# EAGLE design mini system- 5 components vertical moved nano (EAGLE 9.2.2)
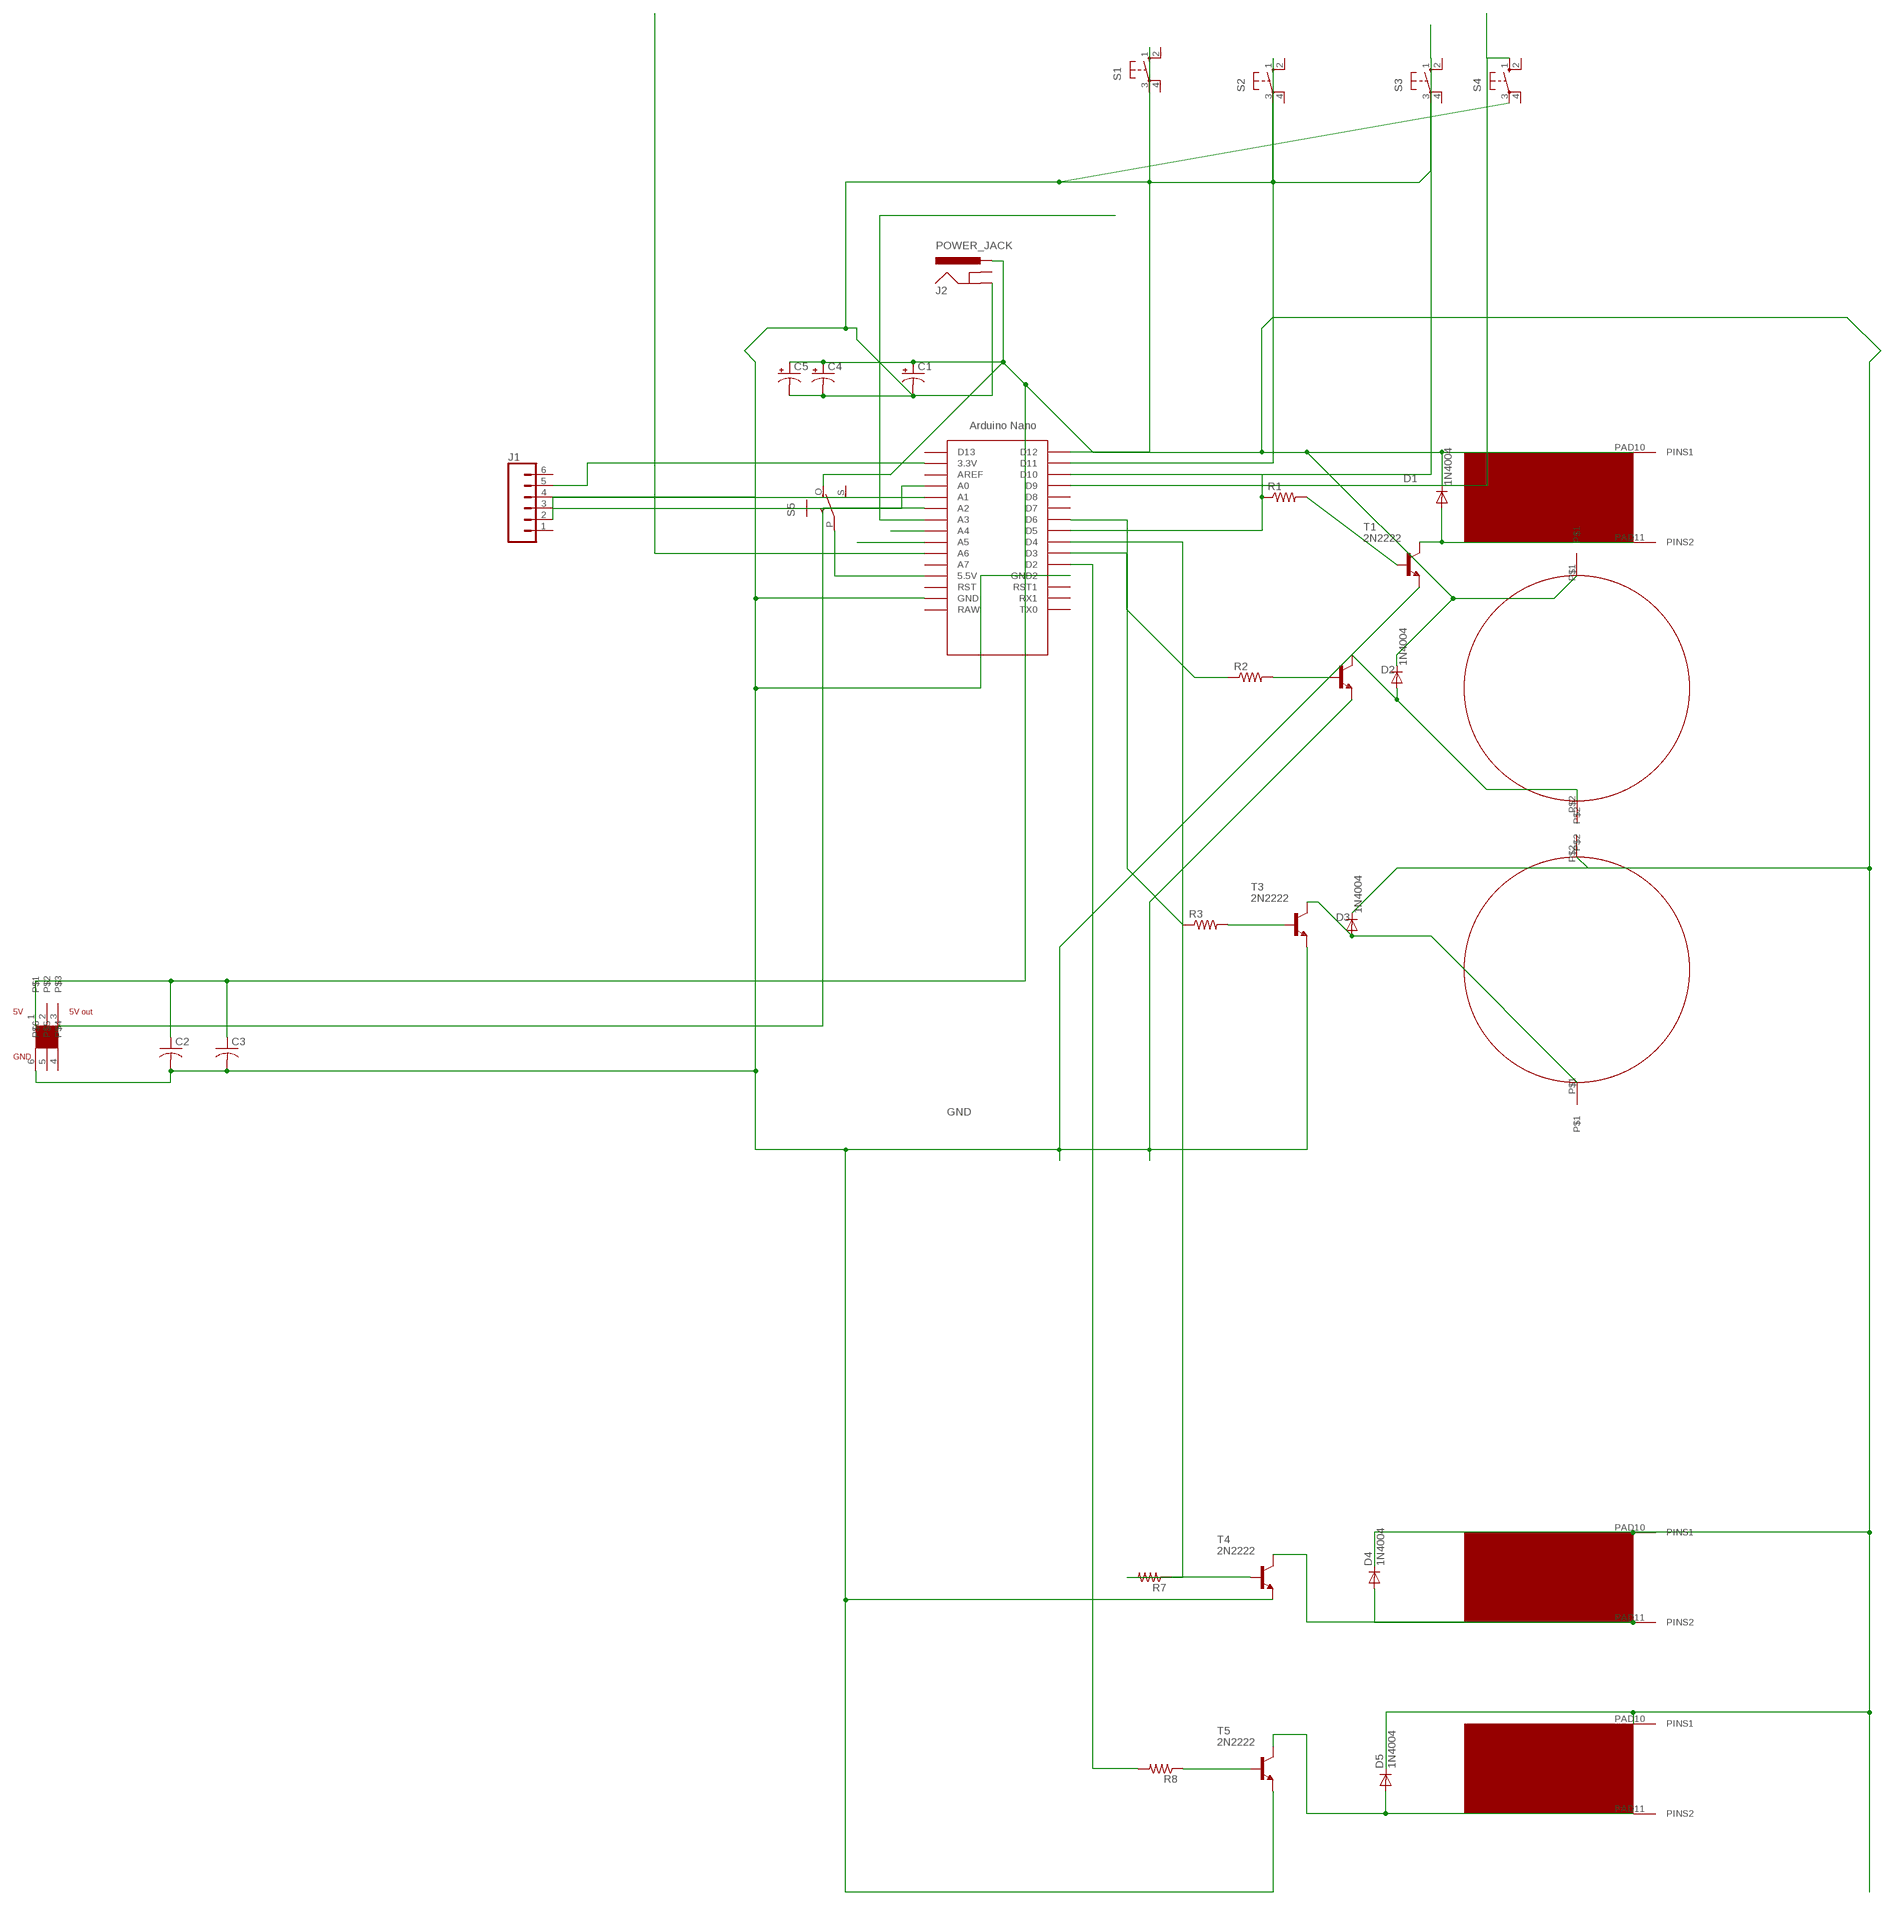
[diagram p0: schematic, sheet 1]

## Parts
C1  CPOL-USE2.5-5  [E2,5-5]
C2  C-US025-024X044  [C025-024X044]
C3  C-US025-024X044  [C025-024X044]
C4  CPOL-USE2.5-5  [E2,5-5]
C5  CPOL-USE2.5-7  [E2,5-7]
D1  1N4004  [DO41-10]
D2  1N4004  [DO41-10]
D3  1N4004  [DO41-10]
D4  1N4004  [DO41-10]
D5  1N4004  [DO41-10]
J1  CONN_06SILK_FEMALE_PTH  [1X06]
J2  POWER_JACK  [POWER_JACK_PTH]
PUMP1  DCPUMP  [PUMP]
R1  R-US_0207/10  [0207/10]
R2  R-US_0207/10  [0207/10]
R3  R-US_0207/10  [0207/10]
R7  R-US_0207/10  [0207/10]
R8  R-US_0207/10  [0207/10]
S1  10-XX  [B3F-10XX]
S2  10-XX  [B3F-10XX]
S3  10-XX  [B3F-10XX]
S4  10-XX  [B3F-10XX]
S5  EG1218S  [EG1218]
T1  2N2222  [TO92-EBC-OVAL]
T2  2N2222  [TO92-EBC-OVAL]
T3  2N2222  [TO92-EBC-OVAL]
T4  2N2222  [TO92-EBC-OVAL]
T5  2N2222  [TO92-EBC-OVAL]
U$1  NANO  [NANO]
U$2  VALVE  [VALVTEST2]
U$3  VALVE  [VALVTEST2]
U$4  DCPUMP  [PUMP]
U$6  VALVE  [VALVTEST2]
U$7  ADP5101  [DIP750W53P254L720H850Q6B]

## Nets
5V: C1.+ C2.1 C3.1 C4.+ C5.+ D1.C D2.C D3.C D4.C D5.C J2.PWR PUMP1.P$1 S5.O U$2.PAD10(PINS1) U$3.PAD10(PINS1) U$4.P$2 U$6.PAD10(PINS1) U$7.1
GND: C1.- C2.2 C3.2 C4.- C5.- J1.4 J2.GND S1.3(P) S2.3(P) S3.3(P) S4.3(P) T1.E T2.E T3.E T4.E T5.E U$1.GND U$1.GND1(GND2) U$7.6
N$1: R1.2 T1.B
N$2: R2.2 T2.B
N$3: R3.2 T3.B
N$4: R1.1 U$1.D5
N$5: D2.A PUMP1.P$2 T2.C
N$6: R3.1 U$1.D6
N$7: R2.1 U$1.D3
N$8: D1.A T1.C U$2.PAD11(PINS2)
N$9: D3.A T3.C U$4.P$1
N$10: R8.2 U$1.D2
N$11: U$1.A3
N$12: J1.5 U$1.3.3V
N$13: J1.3 U$1.A0
N$14: S5.P U$1.5V(5.5V)
N$15: J1.2 U$1.A1
N$16: D4.A T4.C U$3.PAD11(PINS2)
N$17: R7.1 T4.B
N$18: R7.2 U$1.D4
N$19: U$1.A5
N$20: R8.1 T5.B
N$21: D5.A T5.C U$6.PAD11(PINS2)
N$22: U$1.A2 U$7.3
N$23: U$1.A4
N$24: U$1.A6
N$25: S3.1(S) U$1.D10
N$27: S4.1(S) U$1.D9
N$28: S2.1(S) U$1.D11
N$29: S1.1(S) U$1.D12
Unconnected: J1.1 J1.6 J2.GNDBREAK S1.2(S1) S1.4(P1) S2.2(S1) S2.4(P1) S3.2(S1) S3.4(P1) S4.2(S1) S4.4(P1) S5.S U$1.A7 U$1.AREF U$1.D7 U$1.D8 U$1.D13 U$1.RAW U$1.RST U$1.RST1 U$1.RX1 U$1.TX0 U$7.2 U$7.4 U$7.5

## Library data of the parts
C1 C4 C5 = adafruit:CPOL-US: POLARIZED CAPACITOR, American symbol
C2 C3 = rcl:C-US: CAPACITOR, American symbol; SPICEPREFIX: C
D1-D5 = adafruit:1N4004: DIODE General purpose 1N400x type rectifier (With bigger pads) http://www.ladyada.net/library/pcb/eaglelibrary.html
J1 = SparkFun-Connectors:CONN_06: Multi connection point. Often used as Generic Header-pin footprint for 0.1 inch spaced/style header connections On any of the 0.1 inch spaced packages, you can populate with these: Break Away Headers - Straight <https://www.sparkfun.com/products/116> (PRT-00116) Break Away Male Headers - Right Angle <https://www.sparkfun.com/products/553> (PRT-00553) Female Headers <https://www.sparkfun.com/products/115> (PRT-00115) Break Away Headers - Machine Pin <https://www.sparkfun.com/products/117> (PRT-00117) Break Away Female Headers - Swiss Machine Pin <https://www.sparkfun.com/products/743> (PRT-00743) Arduino Stackable Header - 6 Pin <https://www.sparkfun.com/products/9280> (PRT-09280) For SCREWTERMINALS and SPRING TERMINALS visit here: Screw Terimnals on SparkFun.com <https://www.sparkfun.com/search/results?term=Screw+Terminals> (5mm/3.5mm/2.54mm spacing) This device is also useful as a general connection point to wire up your design to another part of your project. Our various solder wires solder well into these plated through hole pads. Hook-Up Wire - Assortment (Stranded, 22 AWG) <https://www.sparkfun.com/products/11375> (PRT-11375) Hook-Up Wire - Assortment (Solid Core, 22 AWG) <https://www.sparkfun.com/products/11367> (PRT-11367) View the entire wire category on our website here <https://www.sparkfun.com/categories/141>; PROD_ID: CONN-08437
J2 = SparkFun-Connectors:POWER_JACK: Power Jack Connector This is the standard 5.5mm barrel jack for power. The PTH is the most common, proven, reliable, footprint. The Slot footprint only works if the mill layer is transmitted to the PCB fab house so be warned. Here are the connectors we sell at SparkFun: DC Barrel Power Jack/Connector <https://www.sparkfun.com/products/119> (PRT-00119) DC Barrel Power Jack/Connector (SMD) <https://www.sparkfun.com/products/12748> (PRT-12748) DC Barrel Jack Adapter - Breadboard Compatible <https://www.sparkfun.com/products/10811> (PRT-10811) It is used on this SparkFun product (and many, many others): SparkFun RedBoard - Programmed with Arduino <https://www.sparkfun.com/products/12757> (DEV-12757) Also, if you need a mating power supply or connector, please check these out: Wall Adapter Power Supply - 9VDC 650mA <https://www.sparkfun.com/products/298> (TOL-00298) DC Barrel Jack Adapter - Male <https://www.sparkfun.com/products/10287> (PRT-10287); PROD_ID: CONN-08197
PUMP1 U$4 = local eagle library:DCPUMP
R1-R3 R7 R8 = adafruit:R-US_: RESISTOR, American symbol
S1-S4 = switch-omron:10-XX: OMRON SWITCH; MPN: B3F-1000; OC_FARNELL: 176432; OC_NEWARK: 36M3542
S5 = adafruit:EG1218: SLIDING SWITCH 0.1" spacing through hole, vertical SPDT slide switch http://www.ladyada.net/library/pcb/eaglelibrary.html
T1-T5 = adafruit:2N2222: NPN TRANSISTOR Big oval pads
U$1 = Arduino-clone:NANO: Arduino Nano
U$2 U$3 U$6 = local eagle library:VALVE: pn eumatic valve
U$7 = local eagle library:ADP5101

## Board
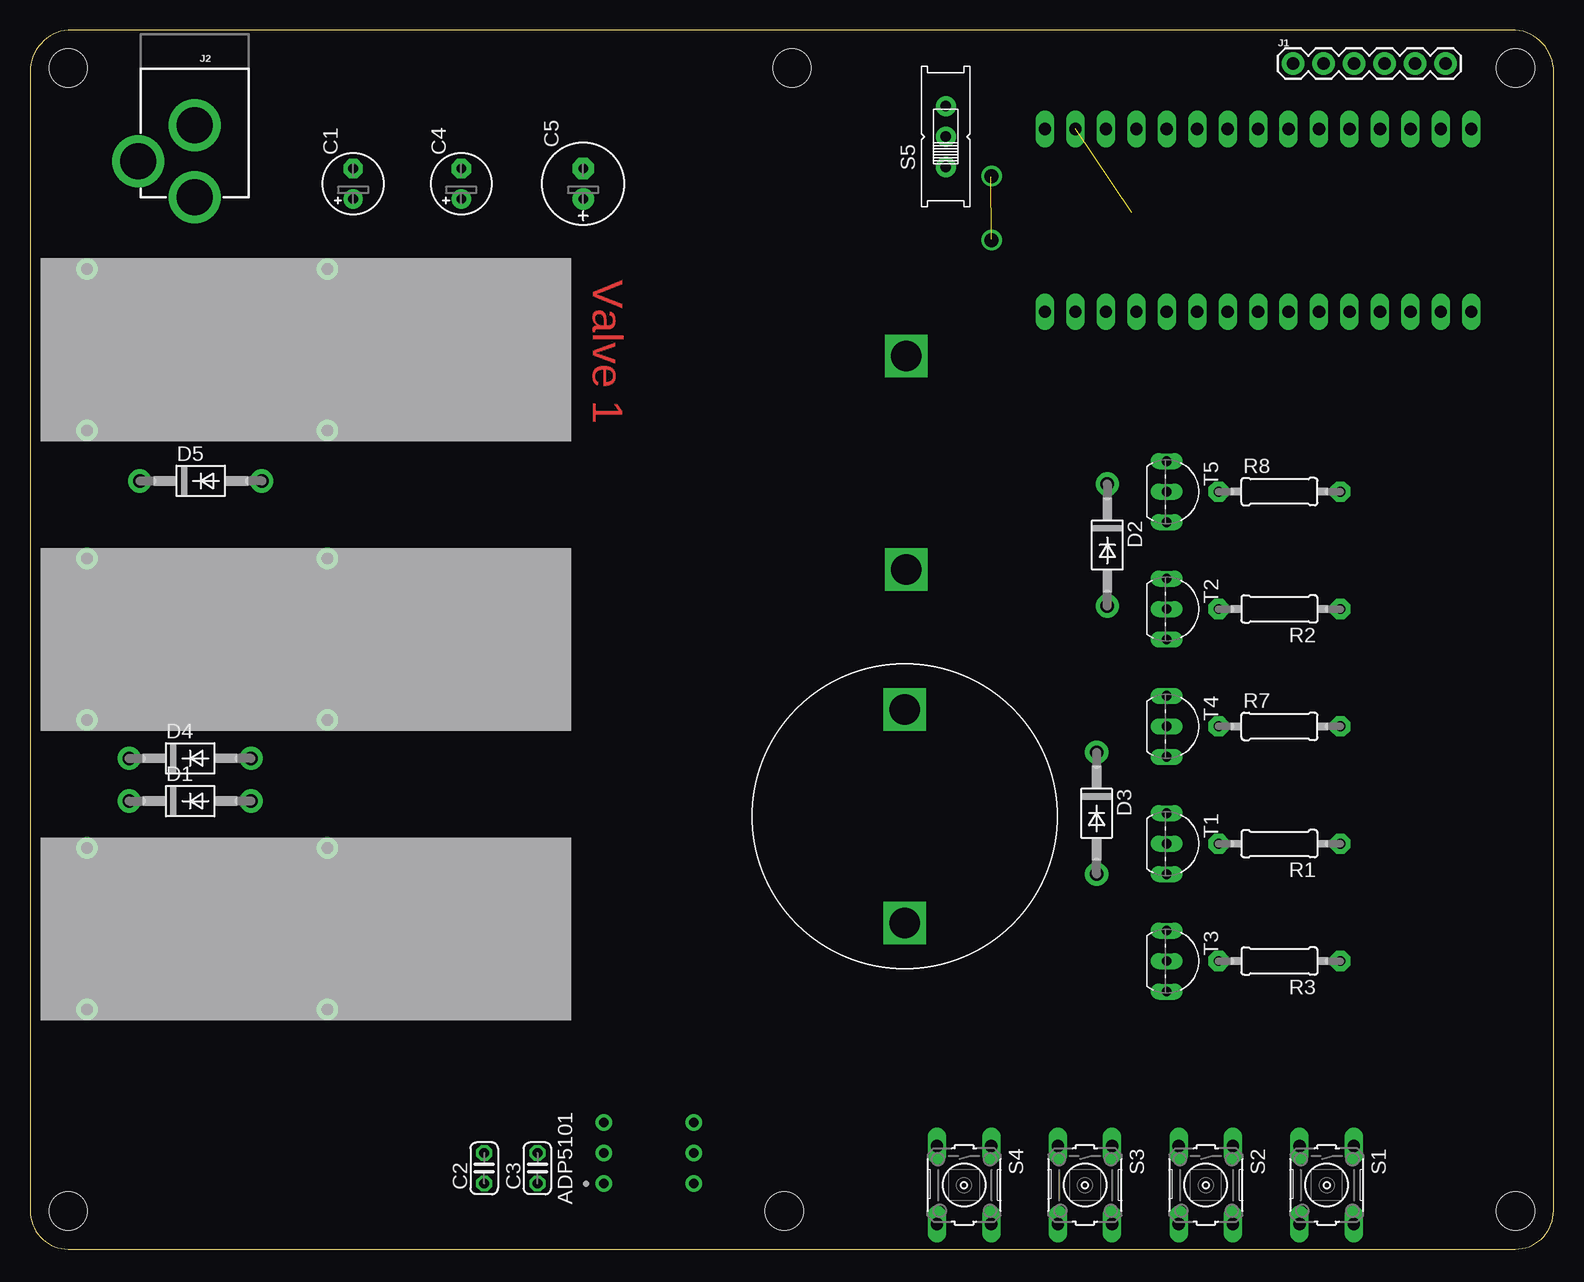
[diagram p1: board, top side]
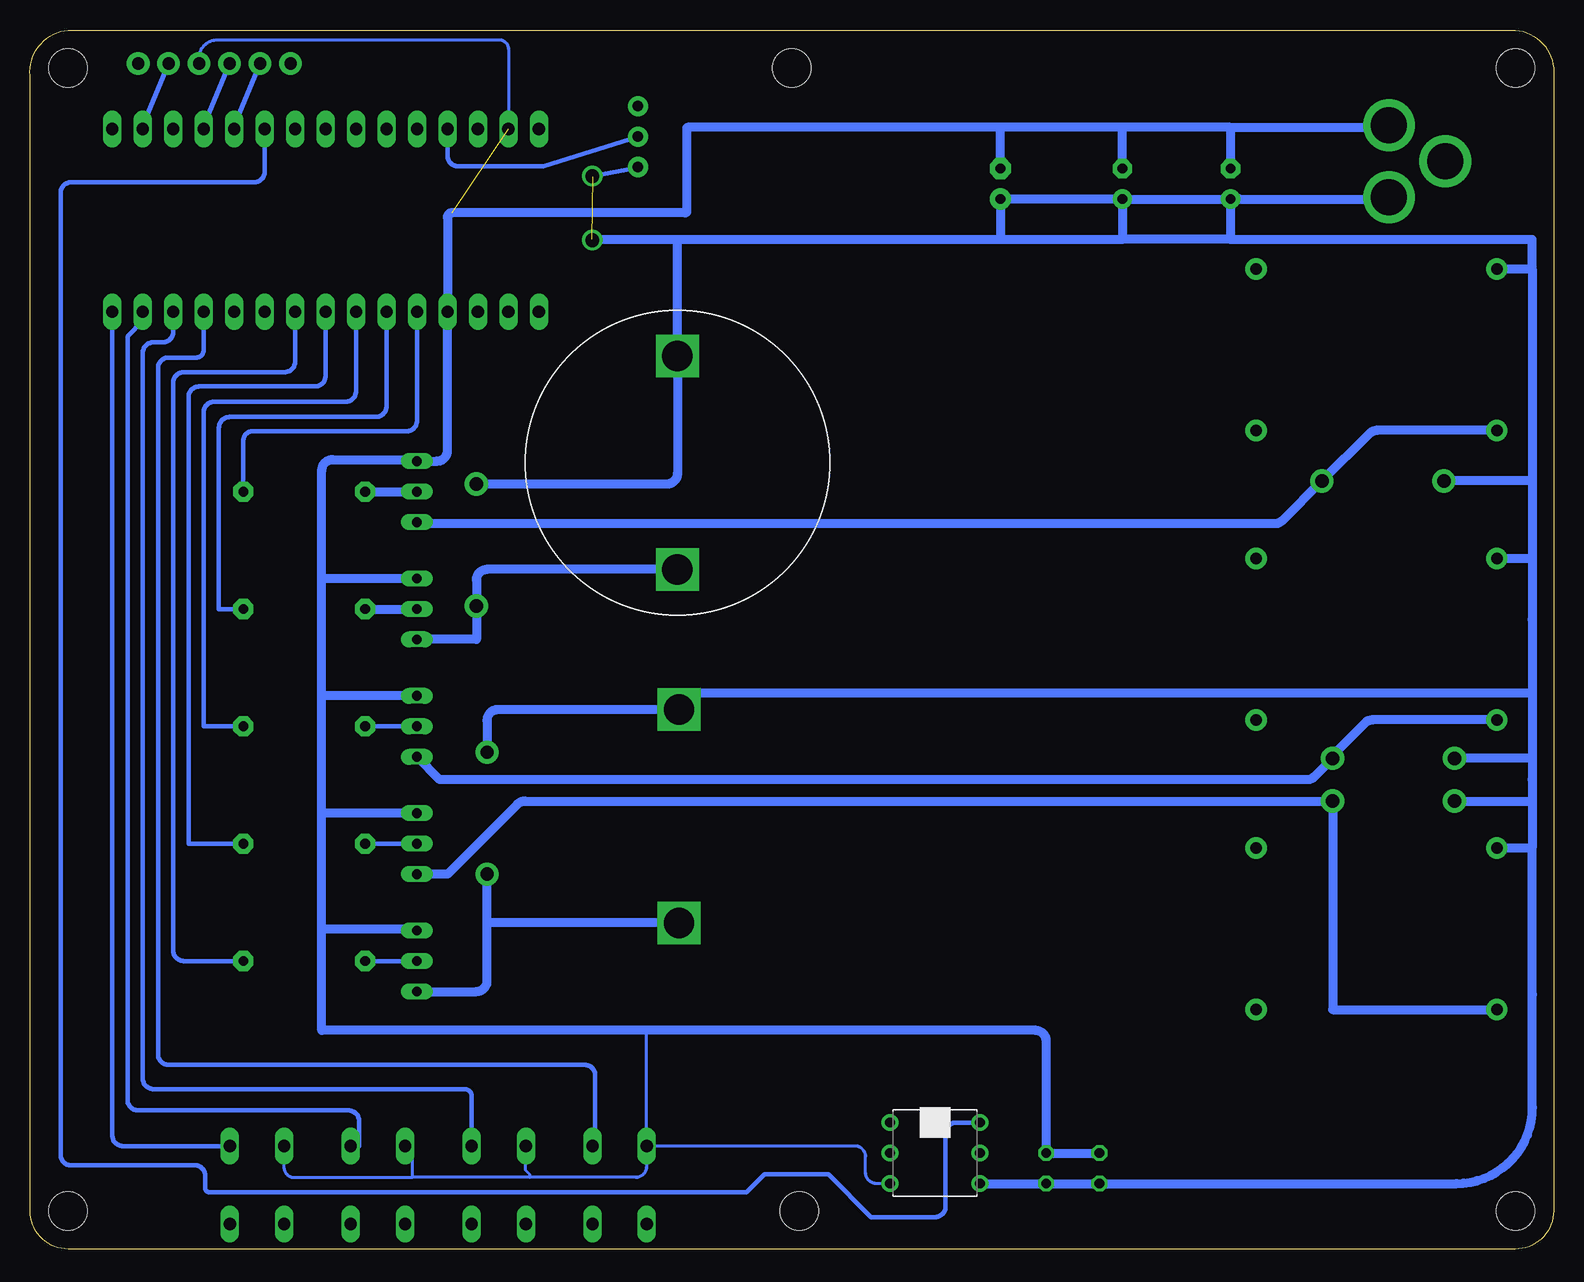
[diagram p2: board, bottom side, seen from below]

Size 127.02 x 101.59 mm. Coordinates in mm from the lower left corner, seen from the top.
Outline: 127,3.17 127,97.78 arc90 123.83,101.59 3.19,101.59 arc90 0.01,97.78 0.01,3.17 arc90 3.19,0 123.83,0 arc90 127,3.17
Copper layers (1*16): Top 0.035mm / dielectric 1.5mm / Bottom 0.035mm
Design rules "default *": minimum track width 6mil, minimum drill 0.35mm, track to track 32mil, track to pad 32mil, pad to pad 6mil, via to via 6mil, smd to smd 6mil, copper to edge 40mil, drill to drill 6mil, minimum pad ring 10mil, minimum via ring 8mil, stop-mask expansion 4mil, vias tented up to drill 0mil, thermal gap 10mil
Holes 3.17 mm at 3.19,98.42 3.19,3.17 123.84,3.17 123.84,98.42 63.51,98.42 62.88,3.17

### Footprints (pad centres in the part's own frame; a part is rotated, then mirrored left to right if it is on the bottom)
E2,5-5 = drill 0.813 pad 1.6: + -1.27,0 | drill 0.813 pad 1.6 octagon: - 1.27,0
C025-024X044 = drill 0.813 octagon: 1 -1.27,0; 2 1.27,0
E2,5-7 = drill 0.813 pad 1.778: + -1.27,0 | drill 0.813 pad 1.778 octagon: - 1.27,0
DO41-10 = drill 1.118 pad 1.93: A 5.08,0; C -5.08,0
1X06 = drill 1.016 pad 1.88: 1 0,0; 2 2.54,0; 3 5.08,0; 4 7.62,0; 5 10.16,0; 6 12.7,0
POWER_JACK_PTH = drill 2.997 pad 4.318: GND 0,7.7; GNDBREAK 4.7,10.7; PWR 0,13.7
PUMP = drill 2.54 square: P$1 -8.89,0; P$2 8.89,0
0207/10 = drill 0.813 pad 1.676 octagon: 1 -5.08,0; 2 5.08,0
B3F-10XX = drill 1.016 long: 1 -3.251,2.261; 2 3.251,2.261; 3 -3.251,-2.261; 4 3.251,-2.261
EG1218 = drill 0.9 pad 1.676: O -2.54,0; P 0,0; S 2.54,0
TO92-EBC-OVAL = drill 0.813 long: B 0,-1.27; C 2.54,-1.27; E -2.54,-1.27
NANO = drill 1.016 long: 3.3V -10.16,24.13; 5V -10.16,-1.27; A0 -10.16,19.05; A1 -10.16,16.51; A2 -10.16,13.97; A3 -10.16,11.43; A4 -10.16,8.89; A5 -10.16,6.35; A6 -10.16,3.81; A7 -10.16,1.27; AREF -10.16,21.59; D2 5.08,1.27; D3 5.08,3.81; D4 5.08,6.35; D5 5.08,8.89; D6 5.08,11.43; D7 5.08,13.97; D8 5.08,16.51; D9 5.08,19.05; D10 5.08,21.59; D11 5.08,24.13; D12 5.08,26.67; D13 -10.16,26.67; GND -10.16,-6.35; GND1 5.08,-1.27; RAW -10.16,-8.89; RST -10.16,-3.81; RST1 5.08,-3.81; RX1 5.08,-6.35; TX0 5.08,-8.89
VALVTEST2 = drill 0.965 pad 1.778: PAD10 3.835,-0.864; PAD11 3.835,-14.326; PAD12 23.901,-14.326; PAD13 23.901,-0.864
DIP750W53P254L720H850Q6B = drill 0.813 pad 1.397: 1 -2.54,3.75; 2 0,3.75; 3 2.54,3.75; 4 2.54,-3.75; 5 0,-3.75; 6 -2.54,-3.75

### Placement (x,y rotation side)
C1  26.94,88.77 90 top
C2  37.86,6.73 90 top
C3  42.31,6.73 90 top
C4  35.96,88.77 90 top
C5  46.12,88.77 90 top
D1  13.35,37.34 0 top
D2  89.8,58.67 270 top
D3  88.91,36.32 270 top
D4  13.35,40.89 0 top
D5  14.24,64.01 0 top
J1  105.3,98.81 0 top
J2  13.73,101.35 180 top
PUMP1  73.04,65.53 270 bottom
R1  104.15,33.78 180 top
R2  104.15,53.34 180 top
R3  104.15,24 180 top
R7  104.15,43.56 0 top
R8  104.15,63.12 0 top
S1  108.09,5.33 270 top
S2  98.02,5.33 270 top
S3  87.94,5.33 270 top
S4  77.87,5.33 270 top
S5  76.34,92.71 90 top
T1  96.03,33.78 270 top
T2  96.03,53.34 270 top
T3  96.03,24 270 top
T4  96.03,43.56 270 top
T5  96.03,63.12 270 top
U$1  93.49,83.19 270 top
U$2  0.9,34.29 0 top
U$3  0.9,58.42 0 top
U$4  72.91,36.07 90 top
U$6  0.9,82.55 0 top
U$7  51.58,8 90 top

### Tracks (layer width: path | path; a pad name or v marks a point on that pad's centre or on a via)
5V  (via drill 1.14)  (1 unrouted)
  Top 0.381: 80.1,89.36 v80.15,89.41
  Bottom 0.381: v80.15,84.07 80.15,84.14 | v80.15,89.41 76.4,90.11 S5.O | C4.+ 33.8,87.5
  Bottom 0.762: 73.04,84.14 PUMP1.P$1 73.04,64.64 arc90 73.93,63.75 D2.C | 80.15,84.14 73.04,84.14 | 73.04,84.14 46.24,84.14 | 46.24,84.14 35.96,84.14 | 26.94,84.14 1.79,84.14 1.79,81.69 | U$6.PAD10 1.79,81.69 | 1.79,81.69 1.79,64.01 | 1.79,52.45 1.79,40.89 | 1.79,40.89 1.79,39.12 | 1.79,40.89 D4.C | 1.79,64.01 1.79,57.56 | U$3.PAD10 1.79,57.56 | 1.79,57.56 1.79,52.45 | 1.79,52.45 1.79,46.35 71.15,46.35 arc-45 71.78,46.09 U$4.P$2 88.03,44.96 arc-90 88.91,44.07 D3.C | 1.79,64.01 D5.C | 1.79,52.45 | 1.79,39.12 arc-45 1.79,39.12 | 1.79,39.12 1.79,37.34 | U$2.PAD10 1.79,33.43 | D1.C 1.79,37.34 | 1.79,33.43 1.79,21.23 1.77,21.21 1.77,11.81 arc90 8.12,5.46 C2.1 C3.1 U$7.1 | 1.79,37.34 1.79,33.43 | 26.18,87.51 C1.+ | C1.+ 26.94,84.14 | C4.+ 35.96,84.14 | C4.+ C1.+ | C1.+ 14.08,87.5 arc-45 J2.PWR | 26.94,84.14 35.96,84.14 | 46.24,84.14 46.12,84.26 C5.+ C4.+
GND  (1 unrouted)
  Bottom 0.254: S4.3 58.24,8.59 arc90 57.36,7.7 57.36,6.35 arc-90 56.47,5.46 U$7.6 | 85.36,5.97 95.14,5.97 | S1.3 105.86,6.87 arc-91 104.97,5.97 95.14,5.97 | 95.14,5.97 95.11,7.93 S2.3 | S3.3 85.71,6.58 85.36,6.22 85.36,5.97 | S4.3 75.63,6.84 arc89 76.52,5.97 85.36,5.97 | 75.65,18.22 75.65,8.63 S4.3 | J1.4 112.92,99.25 arc90 111.39,100.78 87.9,100.78 arc90 87.14,100.01 U$1.GND
  Bottom 0.762: 102.69,55.88 102.69,64.9 arc90 101.81,65.79 94.88,65.79 T5.E 93.11,65.66 arc-90 92.22,66.55 U$1.GND1 92.22,85.98 arc90 91.84,86.36 72.4,86.36 arc-90 72.28,86.49 72.28,93.34 arc90 72.15,93.47 45.99,93.47 | C2.2 C3.2 42.31,17.34 arc-90 43.19,18.22 75.65,18.22 102.69,18.22 102.69,26.67 | 102.69,26.67 102.69,36.32 | 102.69,36.32 102.69,46.1 | 102.69,46.1 102.69,55.88 | T2.E 102.69,55.88 | T4.E 102.69,46.1 | T1.E 102.69,36.32 | T3.E 94.76,26.67 102.69,26.67 | 26.94,93.47 35.96,93.47 | 35.96,93.47 45.99,93.47 | 26.94,93.47 C1.- | C4.- 35.96,93.47 | 26.94,93.47 14.15,93.47 arc-45 J2.GND | C5.- 46.12,93.34 45.99,93.47
N$1
  Bottom 0.381: R1.2 T1.B
N$2
  Bottom 0.762: R2.2 T2.B
N$3
  Bottom 0.381: R3.2 T3.B
N$4
  Bottom 0.381: R1.1 113.81,33.78 113.81,70.99 arc90 112.92,71.88 103.27,71.88 arc-90 102.38,72.77 U$1.D5
N$5
  Bottom 0.762: T2.C 89.8,50.8 D2.A 89.8,55.75 arc90 88.91,56.64 PUMP1.P$2
N$6
  Bottom 0.381: R3.1 114.19,24 arc90 115.08,24.89 115.08,72.19 arc90 114.19,73.08 105.81,73.08 arc-90 104.92,73.97 U$1.D6
  Bottom 0.762: R3.1 109.49,24.26
N$7
  Bottom 0.381: R2.1 111.27,53.34 111.27,68.45 arc90 110.38,69.34 98.19,69.34 arc-90 97.3,70.23 U$1.D3
N$8
  Bottom 0.762: U$2.PAD11 18.43,19.96 D1.A 85.75,37.34 arc-45 86.38,37.08 92.22,31.24 T1.C
N$9
  Bottom 0.381: D3.A 88.79,31.11
  Bottom 0.762: T3.C 89.8,21.46 arc-90 88.91,22.35 88.91,27.18 | 88.91,27.18 D3.A | U$4.P$1 88.91,27.18
N$10
  Bottom 0.381: U$1.D2 94.76,69.04 arc90 95.65,68.15 108.47,68.15 arc-90 109.23,67.39 R8.2
N$12
  Bottom 0.381: U$1.3.3V 117.62,93.6 J1.5
N$13
  Bottom 0.381: U$1.A0 112.54,93.6 J1.3
N$14
  Bottom 0.381: U$1.5V 92.22,91.12 arc-90 91.33,90.23 84.22,90.23 S5.P
N$15
  Bottom 0.381: U$1.A1 110,93.6 J1.2
N$16
  Bottom 0.381: 18.56,41.02 D4.A
  Bottom 0.762: U$3.PAD11 15.11,44.09 arc-45 15.74,43.83 18.56,41.02 | D4.A 19.95,39.38 arc45 20.58,39.12 92.85,39.12 T4.C
N$17
  Bottom 0.381: R7.1 T4.B
N$18
  Bottom 0.381: R7.2 112.54,43.56 112.54,69.72 arc90 111.65,70.61 100.73,70.61 arc-90 99.84,71.5 U$1.D4
N$20
  Bottom 0.762: R8.1 T5.B
N$21
  Bottom 0.762: U$6.PAD11 14.73,68.22 arc-45 15.36,67.96 D5.A 22.61,60.71 arc45 23.24,60.45 93.99,60.45 94.12,60.58 T5.C
N$22
  Bottom 0.381: U$1.A2 107.46,89.79 arc90 108.35,88.9 123.59,88.9 arc-90 124.47,88.01 124.47,7.87 arc-90 123.59,6.99 113.3,6.99 arc90 112.41,6.1 112.41,5.07 arc-90 112.09,4.75 67.27,4.75 65.8,6.22 60.47,6.22 56.91,2.67 51.58,2.67 arc-90 50.69,3.56 50.69,9.65 arc90 49.8,10.54 U$7.3
N$25
  Bottom 0.381: S3.1 90.2,12.74 arc-90 90.79,13.34 116.73,13.34 arc90 117.62,14.22 117.62,74.68 arc90 116.73,75.56 115.97,75.56 arc-90 115.08,76.45 U$1.D10
N$27
  Bottom 0.381: S4.1 79.9,8.81 79.9,14.46 arc-90 80.79,15.35 115.46,15.35 arc90 116.35,16.24 116.35,73.41 arc90 115.46,74.3 113.17,74.3 arc-90 112.54,74.93 U$1.D9
N$28
  Bottom 0.381: U$1.D11 117.62,77.34 118.89,76.07 118.89,12.45 arc-90 118,11.56 100.47,11.56 arc90 99.58,10.67 99.58,8.59 S2.1
N$29
  Bottom 0.381: U$1.D12 120.16,9.47 arc-90 119.27,8.59 S1.1

### Text on the board
Top: Valve 1